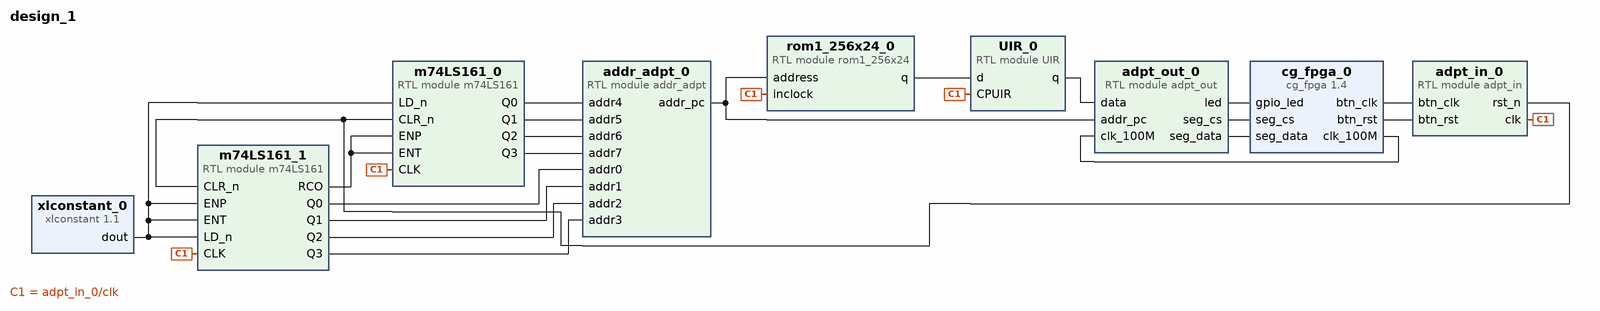
[diagram p0: block diagram of the top level]
# Vivado block design design_1, xc7z020clg400-1, Vivado 2024.2
create_bd_design design_1

create_bd_cell -type ip -vlnv educg.net:user:cg_fpga:1.4 cg_fpga_0
create_bd_cell -type module -reference adpt_in adpt_in_0
create_bd_cell -type module -reference addr_adpt addr_adpt_0
create_bd_cell -type module -reference m74LS161 m74LS161_0
create_bd_cell -type module -reference m74LS161 m74LS161_1
create_bd_cell -type module -reference UIR UIR_0
create_bd_cell -type module -reference rom1_256x24 rom1_256x24_0
create_bd_cell -type ip -vlnv xilinx.com:ip:xlconstant:1.1 xlconstant_0
create_bd_cell -type module -reference adpt_out adpt_out_0

# ---- connections ----

connect_bd_net [get_bd_pins UIR_0/q] [get_bd_pins adpt_out_0/data]
connect_bd_net [get_bd_pins addr_adpt_0/addr_pc] [get_bd_pins rom1_256x24_0/address] [get_bd_pins adpt_out_0/addr_pc]
connect_bd_net [get_bd_pins adpt_in_0/clk] \
  [get_bd_pins m74LS161_1/CLK] [get_bd_pins m74LS161_0/CLK] [get_bd_pins rom1_256x24_0/inclock] [get_bd_pins UIR_0/CPUIR]
connect_bd_net [get_bd_pins adpt_in_0/rst_n] [get_bd_pins m74LS161_0/CLR_n] [get_bd_pins m74LS161_1/CLR_n]
connect_bd_net [get_bd_pins adpt_out_0/led] [get_bd_pins cg_fpga_0/gpio_led]
connect_bd_net [get_bd_pins adpt_out_0/seg_cs] [get_bd_pins cg_fpga_0/seg_cs]
connect_bd_net [get_bd_pins adpt_out_0/seg_data] [get_bd_pins cg_fpga_0/seg_data]
connect_bd_net [get_bd_pins cg_fpga_0/btn_clk] [get_bd_pins adpt_in_0/btn_clk]
connect_bd_net [get_bd_pins cg_fpga_0/btn_rst] [get_bd_pins adpt_in_0/btn_rst]
connect_bd_net [get_bd_pins cg_fpga_0/clk_100M] [get_bd_pins adpt_out_0/clk_100M]
connect_bd_net [get_bd_pins m74LS161_0/Q0] [get_bd_pins addr_adpt_0/addr4]
connect_bd_net [get_bd_pins m74LS161_0/Q1] [get_bd_pins addr_adpt_0/addr5]
connect_bd_net [get_bd_pins m74LS161_0/Q2] [get_bd_pins addr_adpt_0/addr6]
connect_bd_net [get_bd_pins m74LS161_0/Q3] [get_bd_pins addr_adpt_0/addr7]
connect_bd_net [get_bd_pins m74LS161_1/Q0] [get_bd_pins addr_adpt_0/addr0]
connect_bd_net [get_bd_pins m74LS161_1/Q1] [get_bd_pins addr_adpt_0/addr1]
connect_bd_net [get_bd_pins m74LS161_1/Q2] [get_bd_pins addr_adpt_0/addr2]
connect_bd_net [get_bd_pins m74LS161_1/Q3] [get_bd_pins addr_adpt_0/addr3]
connect_bd_net [get_bd_pins m74LS161_1/RCO] [get_bd_pins m74LS161_0/ENT] [get_bd_pins m74LS161_0/ENP]
connect_bd_net [get_bd_pins rom1_256x24_0/q] [get_bd_pins UIR_0/d]
connect_bd_net [get_bd_pins xlconstant_0/dout] \
  [get_bd_pins m74LS161_1/ENP] [get_bd_pins m74LS161_1/ENT] [get_bd_pins m74LS161_0/LD_n] [get_bd_pins m74LS161_1/LD_n]

validate_bd_design
save_bd_design
